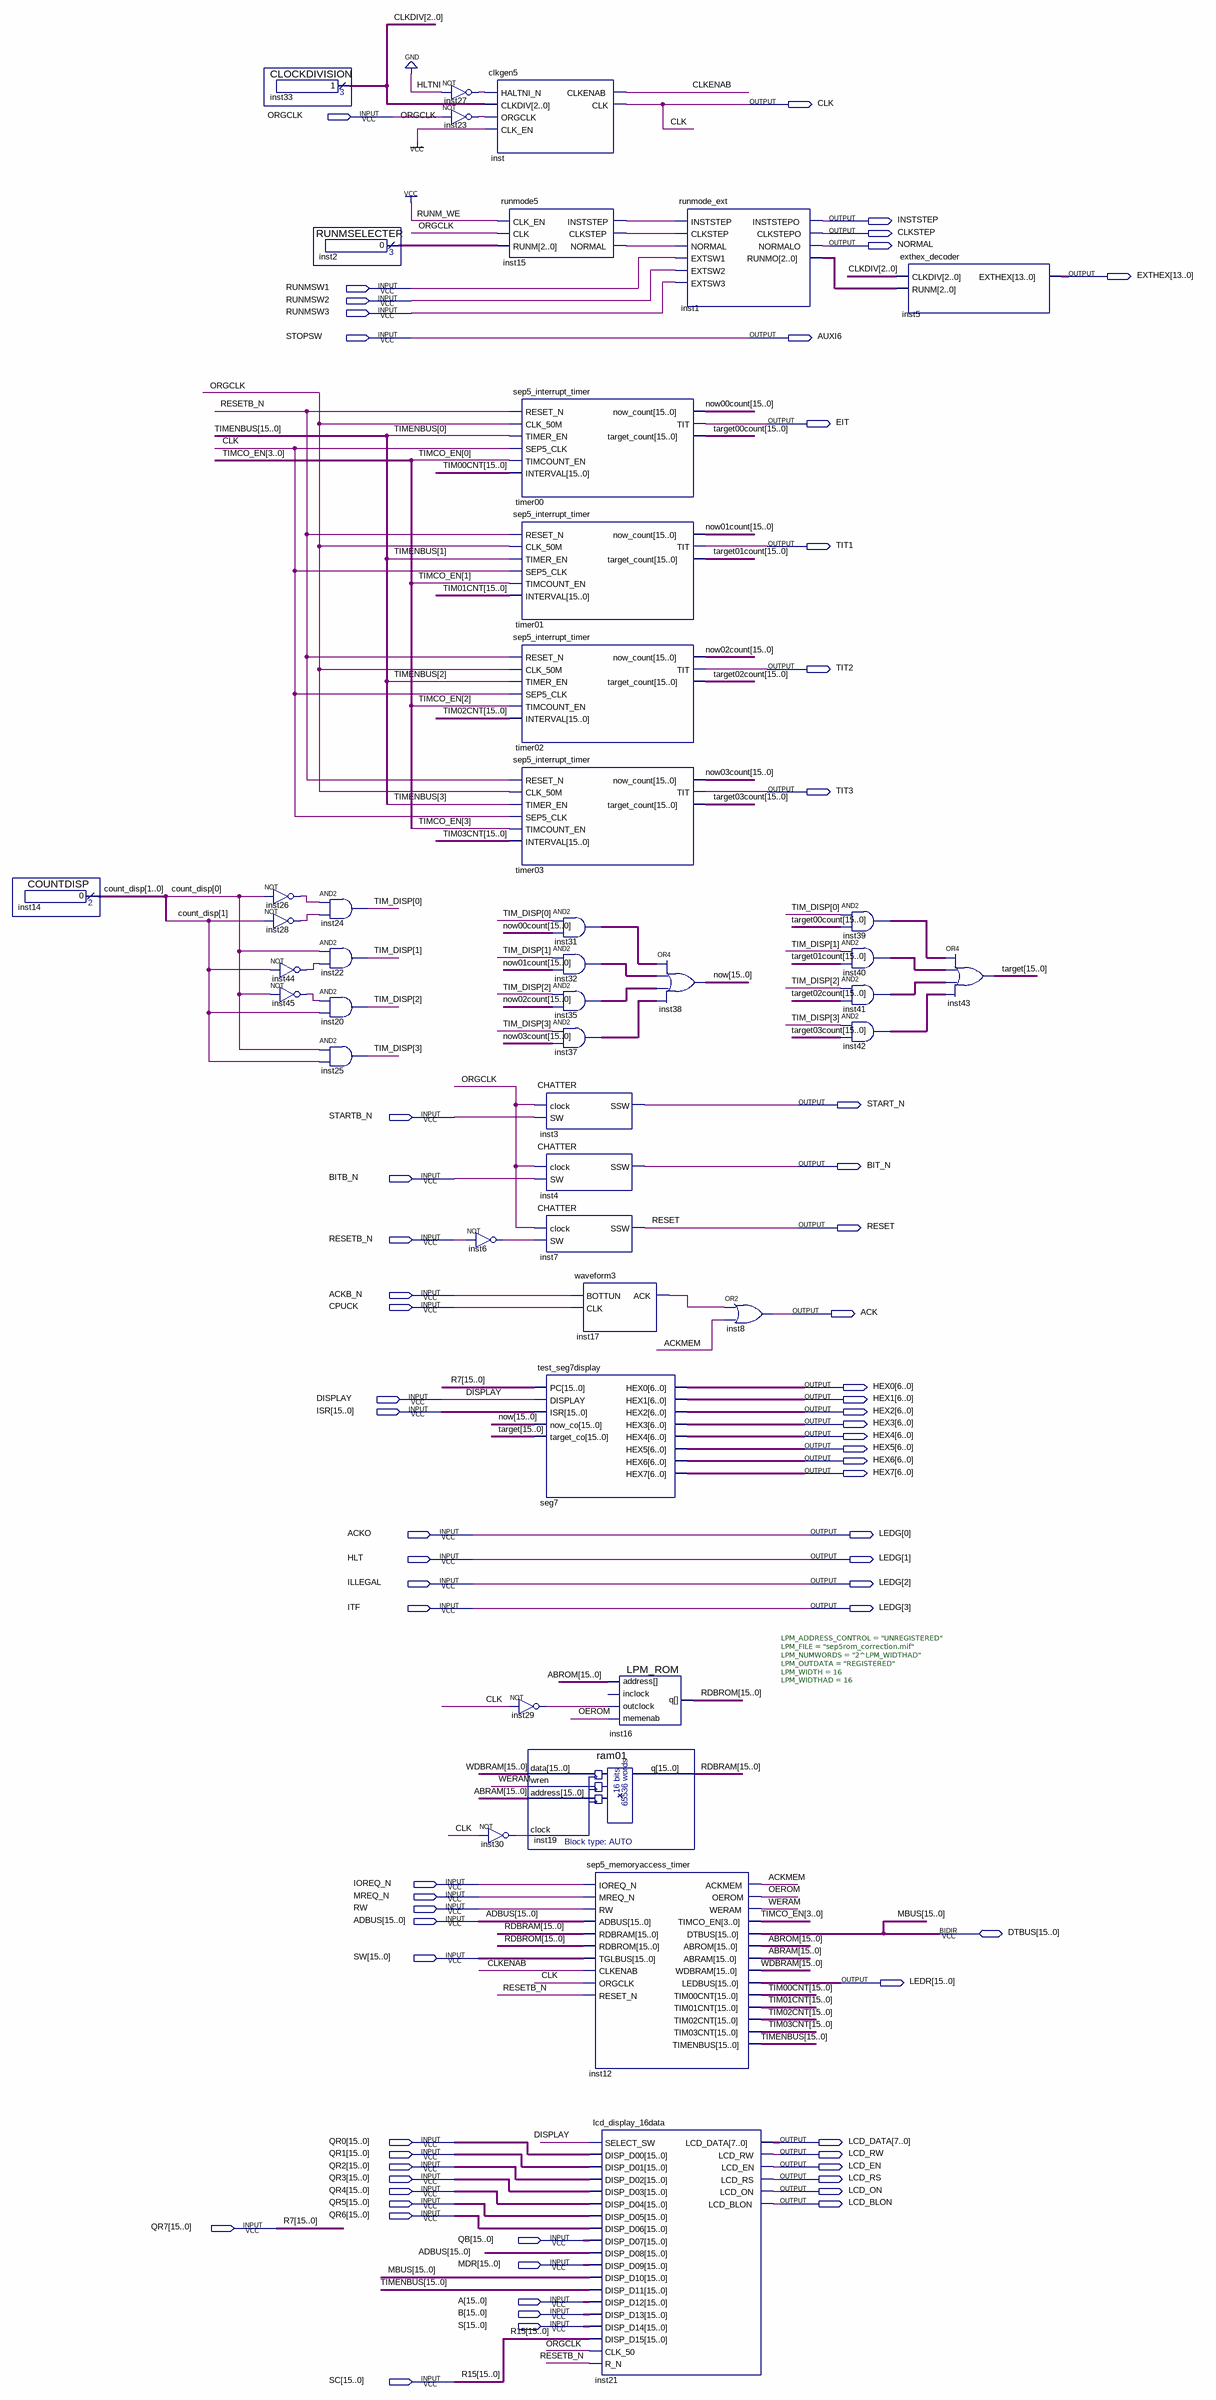
[diagram p0: schematic sheet]
// Quartus schematic sep5_interface.bdf as structural Verilog: 44 symbols, 69 pins
module sep5_interface (
  input  ORGCLK,
  input  RUNMSW1,
  input  RUNMSW2,
  input  RUNMSW3,
  input  STOPSW,
  input  STARTB_N,
  input  BITB_N,
  input  RESETB_N,
  input  ACKB_N,
  input  CPUCK,
  input  DISPLAY,
  input  [15:0] ISR,
  input  ACKO,
  input  HLT,
  input  ILLEGAL,
  input  ITF,
  input  IOREQ_N,
  input  MREQ_N,
  input  RW,
  input  [15:0] ADBUS,
  input  [15:0] SW,
  input  [15:0] QR0,
  input  [15:0] QR1,
  input  [15:0] QR2,
  input  [15:0] QR3,
  input  [15:0] QR4,
  input  [15:0] QR5,
  input  [15:0] QR6,
  input  [15:0] QR7,
  input  [15:0] QB,
  input  [15:0] MDR,
  input  [15:0] A,
  input  [15:0] B,
  input  [15:0] S,
  input  [15:0] SC,
  inout  [15:0] DTBUS,
  output CLK,
  output INSTSTEP,
  output CLKSTEP,
  output NORMAL,
  output [13:0] EXTHEX,
  output AUXI6,
  output EIT,
  output TIT1,
  output TIT2,
  output TIT3,
  output START_N,
  output BIT_N,
  output RESET,
  output ACK,
  output [6:0] HEX0,
  output [6:0] HEX1,
  output [6:0] HEX2,
  output [6:0] HEX3,
  output [6:0] HEX4,
  output [6:0] HEX5,
  output [6:0] HEX6,
  output [6:0] HEX7,
  output [3:0] LEDG,
  output [15:0] LEDR,
  output [7:0] LCD_DATA,
  output LCD_RW,
  output LCD_EN,
  output LCD_RS,
  output LCD_ON,
  output LCD_BLON
);

  wire ACKMEM, CLKENAB, inst6_out, inst15_clkstep, inst15_inststep, inst15_normal, inst17_ack, inst23_out,
       inst26_out, inst27_out, inst28_out, inst29_out, inst30_out, inst44_out, inst45_out, OEROM, WERAM;
  wire [1:0] count_disp;
  wire [2:0] CLKDIV, inst1_runmo, inst2_result;
  wire [3:0] TIM_DISP, TIMCO_EN;
  wire [15:0] ABRAM, ABROM, inst31_out, inst32_out, inst35_out, inst37_out, inst39_out, inst40_out,
       inst41_out, inst42_out, now, now00count, now01count, now02count, now03count, RDBRAM, RDBROM, target,
       target00count, target01count, target02count, target03count, TIM00CNT, TIM01CNT, TIM02CNT, TIM03CNT,
       TIMENBUS, WDBRAM;

  COUNTDISP inst14 (.result(count_disp));
  CLOCKDIVISION inst33 (.result(CLKDIV));
  not inst26 (inst26_out, count_disp[0]);
  not inst28 (inst28_out, count_disp[1]);
  not inst44 (inst44_out, count_disp[1]);
  not inst45 (inst45_out, count_disp[0]);
  RUNMSELECTER inst2 (.result(inst2_result));
  and inst24 (TIM_DISP[0], inst26_out, inst28_out);
  and inst22 (TIM_DISP[1], count_disp[0], inst44_out);
  and inst20 (TIM_DISP[2], inst45_out, count_disp[1]);
  and inst25 (TIM_DISP[3], count_disp[0], count_disp[1]);
  not inst27 (inst27_out, 1'b0);
  not inst23 (inst23_out, ORGCLK);
  not inst6 (inst6_out, RESETB_N);
  not inst30 (inst30_out, CLK);
  clkgen5 inst (
    .HALTNI_N(inst27_out), .CLKDIV(CLKDIV), .ORGCLK(inst23_out), .CLK_EN(1'b1), .CLKENAB(CLKENAB), .CLK(CLK));
  runmode5 inst15 (
    .CLK_EN(1'b1), .CLK(ORGCLK), .RUNM(inst2_result), .INSTSTEP(inst15_inststep), .CLKSTEP(inst15_clkstep),
    .NORMAL(inst15_normal));
  sep5_interrupt_timer timer00 (
    .RESET_N(RESETB_N), .CLK_50M(ORGCLK), .TIMER_EN(TIMENBUS[0]), .SEP5_CLK(CLK), .TIMCOUNT_EN(TIMCO_EN[0]),
    .INTERVAL(TIM00CNT), .now_count(now00count), .TIT(EIT), .target_count(target00count));
  sep5_interrupt_timer timer01 (
    .RESET_N(RESETB_N), .CLK_50M(ORGCLK), .TIMER_EN(TIMENBUS[1]), .SEP5_CLK(CLK), .TIMCOUNT_EN(TIMCO_EN[1]),
    .INTERVAL(TIM01CNT), .now_count(now01count), .TIT(TIT1), .target_count(target01count));
  sep5_interrupt_timer timer02 (
    .RESET_N(RESETB_N), .CLK_50M(ORGCLK), .TIMER_EN(TIMENBUS[2]), .SEP5_CLK(CLK), .TIMCOUNT_EN(TIMCO_EN[2]),
    .INTERVAL(TIM02CNT), .now_count(now02count), .TIT(TIT2), .target_count(target02count));
  sep5_interrupt_timer timer03 (
    .RESET_N(RESETB_N), .CLK_50M(ORGCLK), .TIMER_EN(TIMENBUS[3]), .SEP5_CLK(CLK), .TIMCOUNT_EN(TIMCO_EN[3]),
    .INTERVAL(TIM03CNT), .now_count(now03count), .TIT(TIT3), .target_count(target03count));
  not inst29 (inst29_out, CLK);
  ram01 inst19 (.data(WDBRAM), .wren(WERAM), .address(ABRAM), .clock(inst30_out), .q(RDBRAM));
  assign inst31_out = {16{TIM_DISP[0]}} & now00count;  // AND2 inst31, 16 bits wide
  assign inst32_out = {16{TIM_DISP[1]}} & now01count;  // AND2 inst32, 16 bits wide
  assign inst35_out = {16{TIM_DISP[2]}} & now02count;  // AND2 inst35, 16 bits wide
  assign inst37_out = {16{TIM_DISP[3]}} & now03count;  // AND2 inst37, 16 bits wide
  CHATTER inst3 (.clock(ORGCLK), .SW(STARTB_N), .SSW(START_N));
  CHATTER inst4 (.clock(ORGCLK), .SW(BITB_N), .SSW(BIT_N));
  CHATTER inst7 (.clock(ORGCLK), .SW(inst6_out), .SSW(RESET));
  waveform3 inst17 (.BOTTUN(ACKB_N), .CLK(CPUCK), .ACK(inst17_ack));
  test_seg7display seg7 (
    .PC(QR7), .DISPLAY(DISPLAY), .ISR(ISR), .now_co(now), .target_co(target), .HEX0(HEX0), .HEX1(HEX1),
    .HEX2(HEX2), .HEX3(HEX3), .HEX4(HEX4), .HEX5(HEX5), .HEX6(HEX6), .HEX7(HEX7));
  LPM_ROM #(.LPM_ADDRESS_CONTROL("UNREGISTERED"), .LPM_FILE("sep5rom_correction.mif"), .LPM_NUMWORDS("2^LPM_WIDTHAD"), .LPM_OUTDATA("REGISTERED"), .LPM_WIDTH(16), .LPM_WIDTHAD(16)) inst16 (
    .address(ABROM), .outclock(inst29_out), .memenab(OEROM), .q(RDBROM));  // open: inclock
  sep5_memoryaccess_timer inst12 (
    .IOREQ_N(IOREQ_N), .MREQ_N(MREQ_N), .RW(RW), .ADBUS(ADBUS), .RDBRAM(RDBRAM), .RDBROM(RDBROM),
    .TGLBUS(SW), .CLKENAB(CLKENAB), .ORGCLK(CLK), .RESET_N(RESETB_N), .ACKMEM(ACKMEM), .OEROM(OEROM),
    .WERAM(WERAM), .TIMCO_EN(TIMCO_EN), .ABROM(ABROM), .ABRAM(ABRAM), .WDBRAM(WDBRAM), .LEDBUS(LEDR),
    .TIM00CNT(TIM00CNT), .TIM01CNT(TIM01CNT), .TIM02CNT(TIM02CNT), .TIM03CNT(TIM03CNT), .TIMENBUS(TIMENBUS),
    .DTBUS(DTBUS));
  lcd_display_16data inst21 (
    .SELECT_SW(DISPLAY), .DISP_D00(QR0), .DISP_D01(QR1), .DISP_D02(QR2), .DISP_D03(QR3), .DISP_D04(QR4),
    .DISP_D05(QR5), .DISP_D06(QR6), .DISP_D07(QB), .DISP_D08(ADBUS), .DISP_D09(MDR), .DISP_D10(DTBUS),
    .DISP_D11(TIMENBUS), .DISP_D12(A), .DISP_D13(B), .DISP_D14(S), .DISP_D15(SC), .CLK_50(ORGCLK),
    .R_N(RESETB_N), .LCD_DATA(LCD_DATA), .LCD_RW(LCD_RW), .LCD_EN(LCD_EN), .LCD_RS(LCD_RS), .LCD_ON(LCD_ON),
    .LCD_BLON(LCD_BLON));
  runmode_ext inst1 (
    .INSTSTEP(inst15_inststep), .CLKSTEP(inst15_clkstep), .NORMAL(inst15_normal), .EXTSW1(RUNMSW1),
    .EXTSW2(RUNMSW2), .EXTSW3(RUNMSW3), .INSTSTEPO(INSTSTEP), .CLKSTEPO(CLKSTEP), .NORMALO(NORMAL),
    .RUNMO(inst1_runmo));
  assign now = inst31_out | inst32_out | inst35_out | inst37_out;  // OR4 inst38, 16 bits wide
  or inst8 (ACK, inst17_ack, ACKMEM);
  assign inst39_out = {16{TIM_DISP[0]}} & target00count;  // AND2 inst39, 16 bits wide
  assign inst40_out = {16{TIM_DISP[1]}} & target01count;  // AND2 inst40, 16 bits wide
  assign inst41_out = {16{TIM_DISP[2]}} & target02count;  // AND2 inst41, 16 bits wide
  assign inst42_out = {16{TIM_DISP[3]}} & target03count;  // AND2 inst42, 16 bits wide
  exthex_decoder inst5 (.CLKDIV(CLKDIV), .RUNM(inst1_runmo), .EXTHEX(EXTHEX));
  assign target = inst39_out | inst40_out | inst41_out | inst42_out;  // OR4 inst43, 16 bits wide

  assign AUXI6 = STOPSW;
  assign LEDG = {ITF, ILLEGAL, HLT, ACKO};

  // Other names for the same wires on the sheet: MBUS[15:0] = DTBUS; R7[15:0] = QR7; R15[15:0] = SC
endmodule
